# EAGLE schematic EEZ DIB BP3C r2B3 (EAGLE 7.2.0)
Assembly variants: Farnell, TME

## Sheet 1 of 2
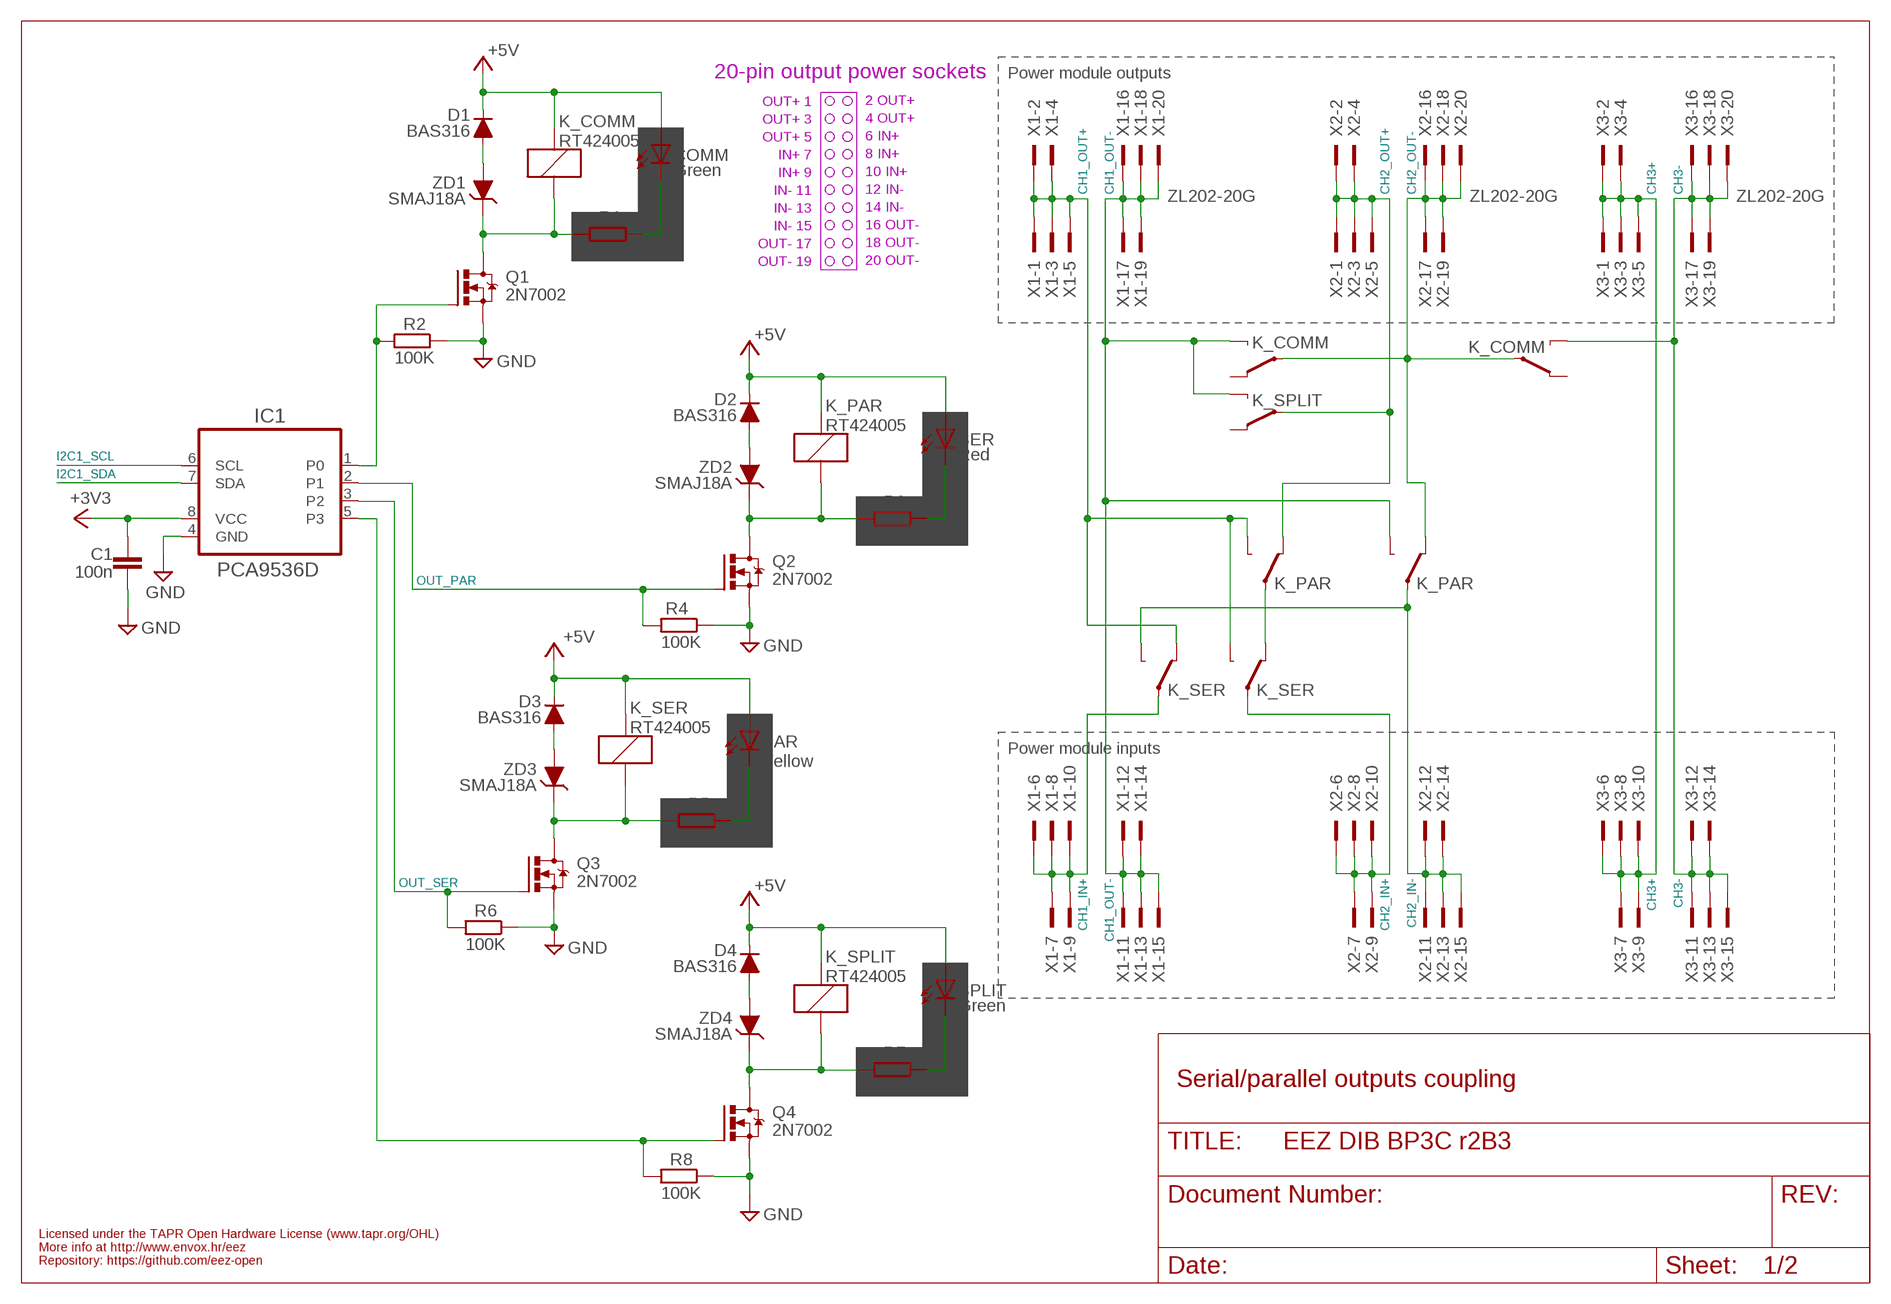
[diagram p0: schematic, sheet 1]

### Parts
C1  100n  C-EUC0603  [C0603]
COMM  Green  LED0805  [LED_0805]
D1  BAS316  DIODESOD323R  [SOD323-R]
D2  BAS316  DIODESOD323R  [SOD323-R]
D3  BAS316  DIODESOD323R  [SOD323-R]
D4  BAS316  DIODESOD323R  [SOD323-R]
IC1  PCA9536D  [SOIC127P600X173-8N]
K_COMM  RT424005  RELAY_RT314012-2  [RT-C/016A5_ROUND]
K_PAR  RT424005  RELAY_RT314012-2  [RT-C/016A5_ROUND]
K_SER  RT424005  RELAY_RT314012-2  [RT-C/016A5_ROUND]
K_SPLIT  RT424005  RELAY_RT314012-2  [RT-C/016A5_ROUND]
PAR  Yellow  LED0805  [LED_0805]
Q1  2N7002  [SOT103P240X110-3N]
Q2  2N7002  [SOT103P240X110-3N]
Q3  2N7002  [SOT103P240X110-3N]
Q4  2N7002  [SOT103P240X110-3N]
R1  330R  R-EU_R0805  [R0805]
R2  100K  R-EU_R0805  [R0805]
R3  330R  R-EU_R0805  [R0805]
R4  100K  R-EU_R0805  [R0805]
R5  330R  R-EU_R0805  [R0805]
R6  100K  R-EU_R0805  [R0805]
R7  330R  R-EU_R0805  [R0805]
R8  100K  R-EU_R0805  [R0805]
SER  Red  LED0805  [LED_0805]
SPLIT  Green  LED0805  [LED_0805]
X1  ZL202-20G  DS1021-210SF11  [DS1021-2*10SF11]
X2  ZL202-20G  DS1021-210SF11  [DS1021-2*10SF11]
X3  ZL202-20G  DS1021-210SF11  [DS1021-2*10SF11]
ZD1  SMAJ18A  PSMAXX  [DO214AC]
ZD2  SMAJ18A  PSMAXX  [DO214AC]
ZD3  SMAJ18A  PSMAXX  [DO214AC]
ZD4  SMAJ18A  PSMAXX  [DO214AC]

### Nets
+3V3: C1.1 IC1.8(VCC) ; also sheet 2
+5V: COMM.A D1.C D2.C D3.C D4.C K_COMM.A2(K:C1) K_PAR.A2(K:C1) K_SER.A2(K:C1) K_SPLIT.A2(K:C1) PAR.A SER.A SPLIT.A ; also sheet 2
CH1_IN+: K_SER.11A(-1:P) X1.6 X1.7 X1.8 X1.9 X1.10
CH1_OUT+: K_PAR.14A(-1:O) K_SER.12A(-1:S) K_SER.14B(-2:O) X1.1 X1.2 X1.3 X1.4 X1.5
CH1_OUT-: K_COMM.14A(-1:O) K_PAR.14B(-2:O) K_SPLIT.14A(-1:O) X1.11 X1.12 X1.13 X1.14 X1.15 X1.16 X1.17 X1.18 X1.19 X1.20
CH2_IN+: K_SER.11B(-2:P) X2.6 X2.7 X2.8 X2.9 X2.10
CH2_IN-: K_PAR.11B(-2:P) K_SER.14A(-1:O) X2.11 X2.12 X2.13 X2.14 X2.15
CH2_OUT+: K_PAR.12A(-1:S) K_SPLIT.11A(-1:P) X2.1 X2.2 X2.3 X2.4 X2.5
CH2_OUT-: K_COMM.11A(-1:P) K_COMM.11B(-2:P) K_PAR.12B(-2:S) X2.16 X2.17 X2.18 X2.19 X2.20
CH3+: X3.1 X3.2 X3.3 X3.4 X3.5 X3.6 X3.7 X3.8 X3.9 X3.10
CH3-: K_COMM.14B(-2:O) X3.11 X3.12 X3.13 X3.14 X3.15 X3.16 X3.17 X3.18 X3.19 X3.20
GND: C1.2 IC1.4(GND) Q1.2(S) Q2.2(S) Q3.2(S) Q4.2(S) R2.1 R4.1 R6.1 R8.1 ; also sheet 2
I2C1_SCL: IC1.6(SCL) ; also sheet 2
I2C1_SDA: IC1.7(SDA) ; also sheet 2
N$7: PAR.C R5.1
N$8: R3.1 SER.C
N$17: K_COMM.A1(K:C2) Q1.3(D) R1.2 ZD1.C
N$18: D1.A ZD1.A
N$19: COMM.C R1.1
N$20: K_SPLIT.A1(K:C2) Q4.3(D) R7.2 ZD4.C
N$21: D4.A ZD4.A
N$22: R7.1 SPLIT.C
N$101: K_SER.A1(K:C2) Q3.3(D) R5.2 ZD3.C
N$102: K_PAR.A1(K:C2) Q2.3(D) R3.2 ZD2.C
N$104: D3.A ZD3.A
N$128: D2.A ZD2.A
OUT_COMM: IC1.1(P0) Q1.1(G) R2.2
OUT_PAR: IC1.2(P1) Q2.1(G) R4.2
OUT_SER: IC1.3(P2) Q3.1(G) R6.2
OUT_SPLIT: IC1.5(P3) Q4.1(G) R8.2
SER_PAR: K_PAR.11A(-1:P) K_SER.12B(-2:S)
Unconnected: K_COMM.12A(-1:S) K_COMM.12B(-2:S) K_SPLIT.11B(-2:P) K_SPLIT.12A(-1:S) K_SPLIT.12B(-2:S) K_SPLIT.14B(-2:O)

### Notes on the sheet
- 20-pin output power sockets | Power module outputs
- OUT+ 1
- 2 OUT+
- OUT+ 3
- 4 OUT+
- OUT+ 5
- 6 IN+
- IN+ 7
- 8 IN+
- IN+ 9
- 10 IN+
- IN- 11
- 12 IN-
- IN- 13
- 14 IN-
- IN- 15
- 16 OUT-
- OUT- 17
- 18 OUT-
- OUT- 19
- 20 OUT-
- Power module inputs
- Serial/parallel outputs coupling
- Licensed under the TAPR Open Hardware License (www.tapr.org/OHL)
- More info at http://www.envox.hr/eez
- Repository: https://github.com/eez-open

## Sheet 2 of 2
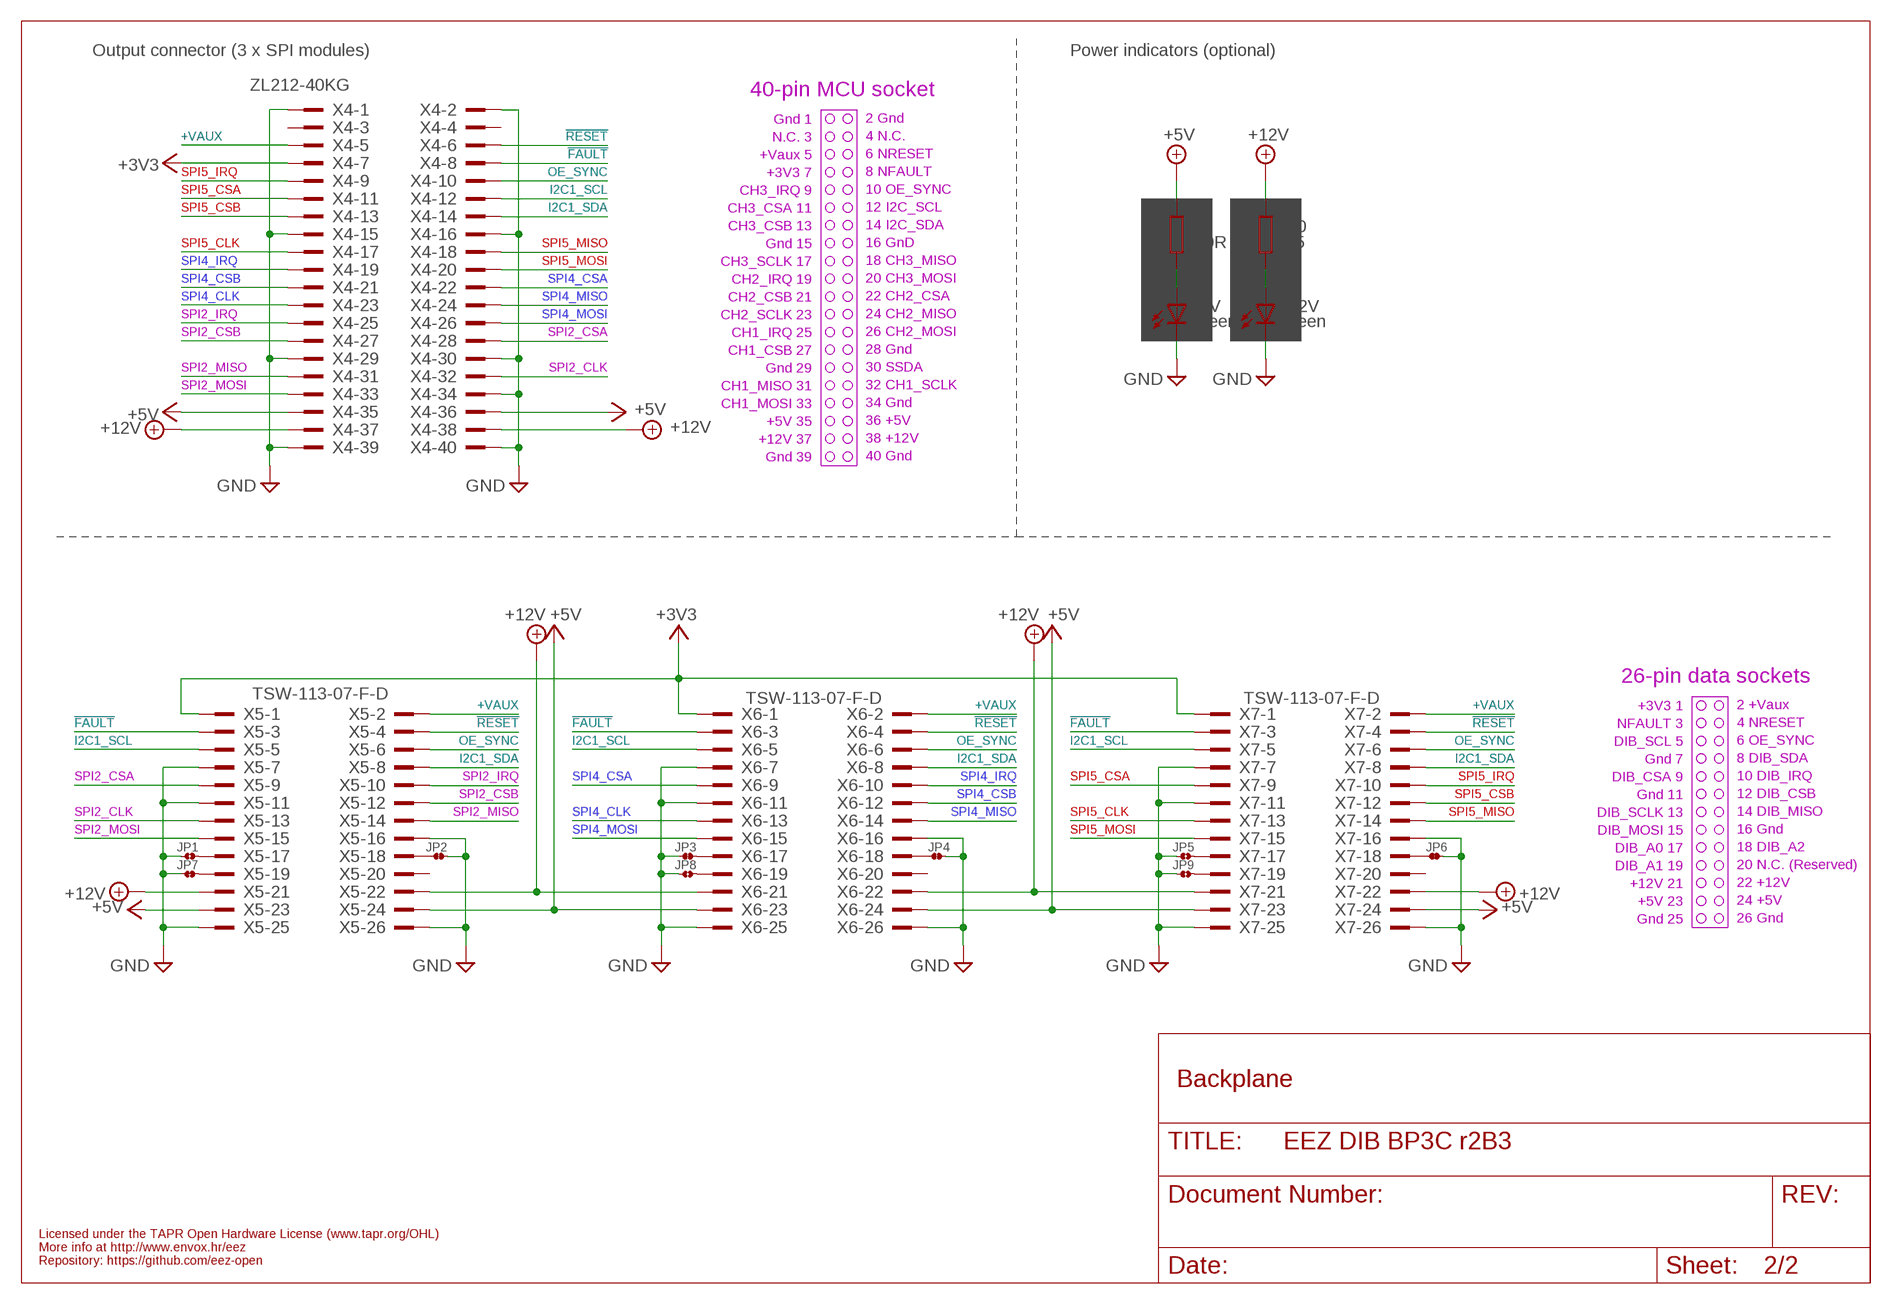
[diagram p1: schematic, sheet 2]

### Parts
+5V  Green  LED0805  [LED_0805]
+12V  Green  LED0805  [LED_0805]
JP1  JP2-CUT  [JP2-CUT]
JP2  JP2-NOCUT  [JP2-NOCUT]
JP3  JP2-NOCUT  [JP2-NOCUT]
JP4  JP2-NOCUT  [JP2-NOCUT]
JP5  JP2-CUT  [JP2-CUT]
JP6  JP2-NOCUT  [JP2-NOCUT]
JP7  JP2-NOCUT  [JP2-NOCUT]
JP8  JP2-CUT  [JP2-CUT]
JP9  JP2-CUT  [JP2-CUT]
R9  470R  R-EU_R0805  [R0805]
R10  1K5  R-EU_R0805  [R0805]
X4  ZL212-40KG  [ZL212-40KG]
X5  TSW-113-07-F-D  [TSW-113-07-F-D]
X6  TSW-113-07-F-D  [TSW-113-07-F-D]
X7  TSW-113-07-F-D  [TSW-113-07-F-D]

### Nets
!FAULT: X4.8 X5.3 X6.3 X7.3
!RESET: X4.6 X5.4 X6.4 X7.4
+3V3: X4.7 X5.1 X6.1 X7.1 ; also sheet 1
+5V: R9.1 X4.35 X4.36 X5.23 X5.24 X6.23 X6.24 X7.23 X7.24 ; also sheet 1
+12V: R10.1 X4.37 X4.38 X5.21 X5.22 X6.21 X6.22 X7.21 X7.22
+VAUX: X4.5 X5.2 X6.2 X7.2
GND: +5V.C +12V.C JP1.1 JP2.2 JP3.1 JP4.2 JP5.1 JP6.2 JP7.1 JP8.1 JP9.1 X4.1 X4.2 X4.15 X4.16 X4.29 X4.30 X4.34 X4.39 X4.40 X5.7 X5.11 X5.16 X5.25 X5.26 X6.7 X6.11 X6.16 X6.25 X6.26 X7.7 X7.11 X7.16 X7.25 X7.26 ; also sheet 1
I2C1_SCL: X4.12 X5.5 X6.5 X7.5 ; also sheet 1
I2C1_SDA: X4.14 X5.8 X6.8 X7.8 ; also sheet 1
N$2: JP1.2 X5.17
N$3: +5V.A R9.2
N$4: +12V.A R10.2
N$5: JP7.2 X5.19
N$6: JP2.1 X5.18
N$9: JP3.2 X6.17
N$11: JP4.1 X6.18
N$13: JP8.2 X6.19
N$14: JP6.1 X7.18
N$15: JP5.2 X7.17
N$16: JP9.2 X7.19
OE_SYNC: X4.10 X5.6 X6.6 X7.6
SPI2_CLK: X4.32 X5.13
SPI2_CSA: X4.28 X5.9
SPI2_CSB: X4.27 X5.12
SPI2_IRQ: X4.25 X5.10
SPI2_MISO: X4.31 X5.14
SPI2_MOSI: X4.33 X5.15
SPI4_CLK: X4.23 X6.13
SPI4_CSA: X4.22 X6.9
SPI4_CSB: X4.21 X6.12
SPI4_IRQ: X4.19 X6.10
SPI4_MISO: X4.24 X6.14
SPI4_MOSI: X4.26 X6.15
SPI5_CLK: X4.17 X7.13
SPI5_CSA: X4.11 X7.9
SPI5_CSB: X4.13 X7.12
SPI5_IRQ: X4.9 X7.10
SPI5_MISO: X4.18 X7.14
SPI5_MOSI: X4.20 X7.15
Unconnected: X4.3 X4.4 X5.20 X6.20 X7.20

### Notes on the sheet
- Output connector (3 x SPI modules) | Power indicators (optional)
- 40-pin MCU socket
- Gnd 1
- 2 Gnd
- N.C. 3
- 4 N.C.
- +Vaux 5
- 6 NRESET
- +3V3 7
- 8 NFAULT
- CH3_IRQ 9
- 10 OE_SYNC
- CH3_CSA 11
- 12 I2C_SCL
- CH3_CSB 13
- 14 I2C_SDA
- Gnd 15
- 16 GnD
- CH3_SCLK 17
- 18 CH3_MISO
- CH2_IRQ 19
- 20 CH3_MOSI
- CH2_CSB 21
- 22 CH2_CSA
- CH2_SCLK 23
- 24 CH2_MISO
- CH1_IRQ 25
- 26 CH2_MOSI
- CH1_CSB 27
- 28 Gnd
- Gnd 29
- 30 SSDA
- CH1_MISO 31
- 32 CH1_SCLK
- CH1_MOSI 33
- 34 Gnd
- +5V 35
- 36 +5V
- +12V 37
- 38 +12V
- Gnd 39
- 40 Gnd
- 26-pin data sockets
- +3V3 1
- 2 +Vaux
- NFAULT 3
- 4 NRESET
- DIB_SCL 5
- 6 OE_SYNC
- Gnd 7
- 8 DIB_SDA
- DIB_CSA 9
- 10 DIB_IRQ
- Gnd 11
- 12 DIB_CSB
- DIB_SCLK 13
- 14 DIB_MISO
- DIB_MOSI 15
- 16 Gnd
- DIB_A0 17
- 18 DIB_A2
- DIB_A1 19
- 20 N.C. (Reserved)
- +12V 21
- 22 +12V
- +5V 23
- 24 +5V
- Gnd 25
- 26 Gnd
- Backplane
- Licensed under the TAPR Open Hardware License (www.tapr.org/OHL)
- More info at http://www.envox.hr/eez
- Repository: https://github.com/eez-open

## Library data of the parts
+5V +12V COMM PAR SER SPLIT = EEZ_Lib1:LED
C1 = rcl:C-EU: CAPACITOR, European symbol
D1-D4 = EEZ_Lib1:DIODE
IC1 = EEZ_DIB:PCA9536: Remote 4-Bit I2C and SMBus I/O Expander With Configuration Registers
JP1 JP5 JP8 JP9 = EEZ_Lib1:JP2-CUT
JP2-JP4 JP6 JP7 = EEZ_Lib1:JP2-NOCUT
K_COMM K_PAR K_SER K_SPLIT = EEZ_Lib1:RELAY_RT314012
Q1-Q4 = EEZ_Lib1:2N7002: N-CHANNEL ENHANCEMENT MODE FIELD EFFECT TRANSISTOR; MPN: 2N7002-7-F; OC_FARNELL: 1713823; OC_NEWARK: 25R5679; PACKAGE: SOT-23-3; SUPPLIER: DIODES INC.
R1-R10 = rcl:R-EU_: RESISTOR, European symbol
X1-X3 = EEZ_connectors:DS1021-2*10SF11: Pin header; pin strips; male; PIN:20; straight; 2.54mm; THT; 2x10; FARNELL: 2025179
X4 = EEZ_connectors:ZL212-40KG
X5-X7 = EEZ_connectors:TSW-113-07-F-D: Samtec TSW-110-07-F-D Header, 2.54MM, THT, 26-way; FARNELL: 2025182
ZD1-ZD4 = EEZ_Lib1:PSMAXX: Transient Voltage Suppressor, TVS, P4SMA Series, Unidirectional

## Net classes
0 default: width 0.152 mm, drill 0.3 mm, clearance 0.152 mm
1 diff: width 0.152 mm, drill 0.3 mm, clearance 0.152 mm
2 gnd: width 0.152 mm, drill 0.3 mm, clearance 0.152 mm